# Altium project BLDC_Driver_1_1.PrjPcb
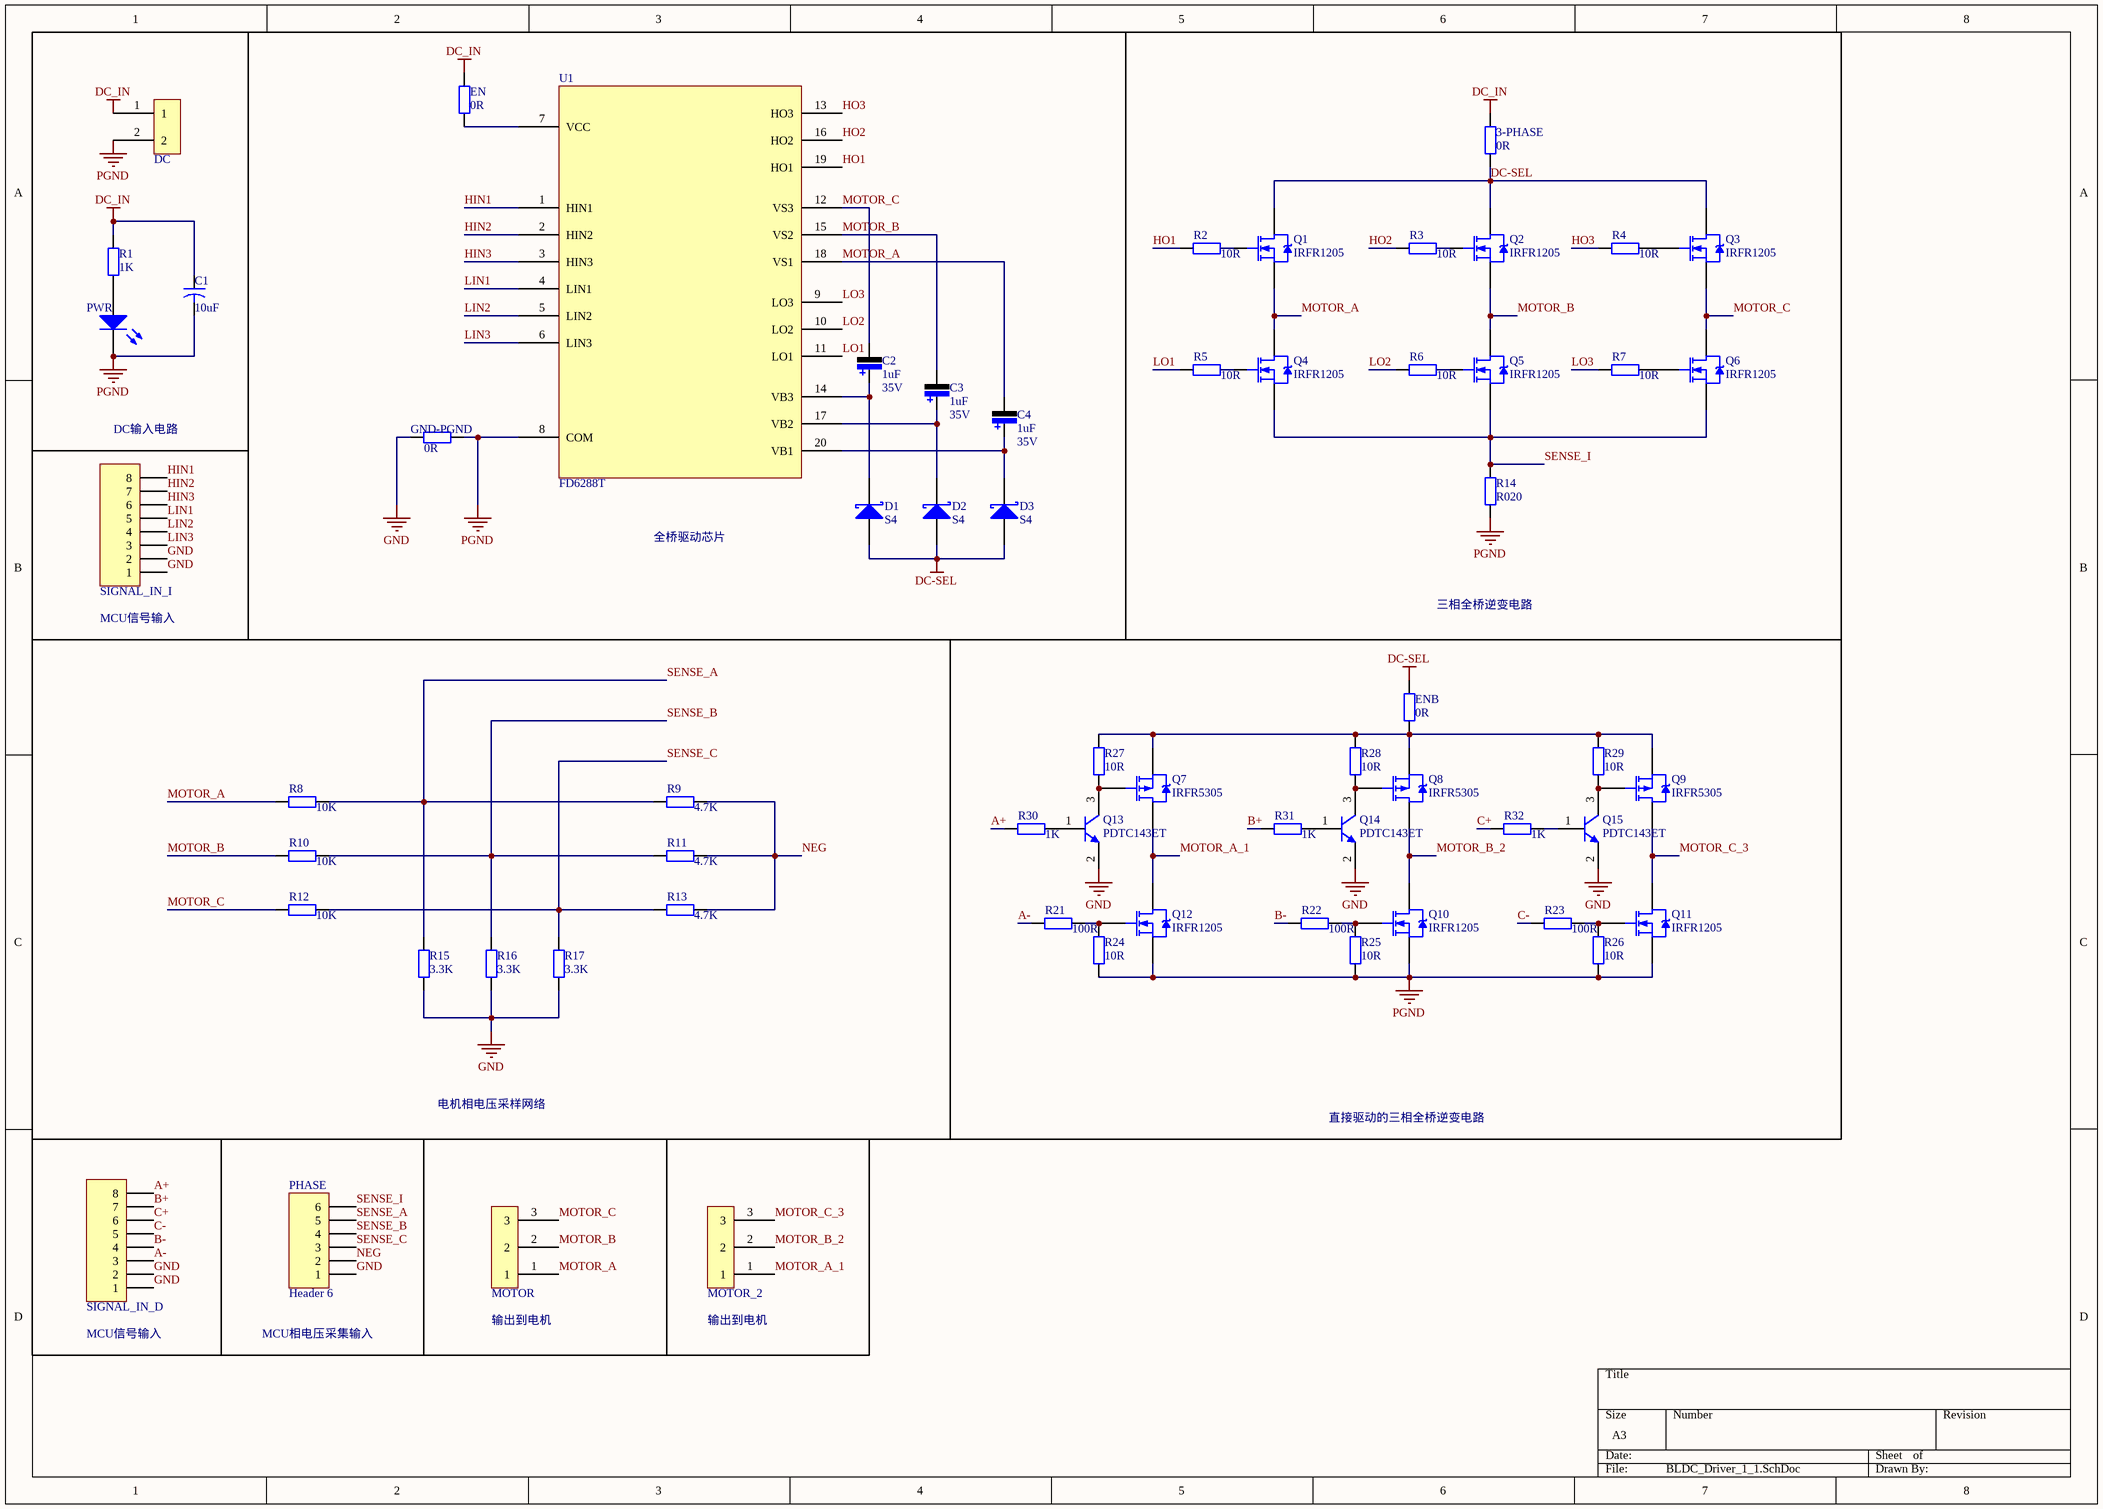
[diagram p0: BLDC_Driver_1_1.SchDoc]
1 sheet, 63 parts. Net scope: global (net labels, ports and power ports of the same name join across sheets).
Board files: BLDC_Driver_1_1.PcbDoc, BLDC_Driver_1_1_2.PcbDoc

## Sheet BLDC_Driver_1_1.SchDoc
size A3

### Parts
3-PHASE  value 0R  [0805-2]  (hidden comment: Res2)
C1  value 10uF  [CAPR5-4X5]  (hidden comment: Cap2)
C2  value 1uF  Vol: 35V  [CAP-3216]  (hidden comment: Cap Pol)
C3  value 1uF  Vol: 35V  [CAP-3216]  (hidden comment: Cap Pol)
C4  value 1uF  Vol: 35V  [CAP-3216]  (hidden comment: Cap Pol)
D1  Type: S4  [DIODE-1206]  (hidden comment: D-Schottky)
D2  Type: S4  [DIODE-1206]  (hidden comment: D-Schottky)
D3  Type: S4  [DIODE-1206]  (hidden comment: D-Schottky)
DC  JXZ2  [JXZ2]  (value not drawn)
EN  value 0R  [0805-2]  (hidden comment: Res2)
ENB  value 0R  [0805-2]  (hidden comment: Res2)
GND-PGND  value 0R  [1206]  (hidden comment: Res2)
MOTOR  JXZ3  [JXZ_3]  (value not drawn)
MOTOR_2  JXZ3  [JXZ_3]  (value not drawn)
PHASE  Header 6  [HDR1X6]
PWR  LED2  [DIODE-1206]  (value not drawn)
Q1  IRFR1205  [TO-252AA_N]
Q2  IRFR1205  [TO-252AA_N]
Q3  IRFR1205  [TO-252AA_N]
Q4  IRFR1205  [TO-252AA_N]
Q5  IRFR1205  [TO-252AA_N]
Q6  IRFR1205  [TO-252AA_N]
Q7  IRFR5305  [TO-252AA_N]
Q8  IRFR5305  [TO-252AA_N]
Q9  IRFR5305  [TO-252AA_N]
Q10  IRFR1205  [TO-252AA_N]
Q11  IRFR1205  [TO-252AA_N]
Q12  IRFR1205  [TO-252AA_N]
Q13  PDTC143ET  [SOT-23]
Q14  PDTC143ET  [SOT-23]
Q15  PDTC143ET  [SOT-23]
R1  value 1K  [1206]  (hidden comment: Res2)
R2  value 10R  [1206]  (hidden comment: Res2)
R3  value 10R  [1206]  (hidden comment: Res2)
R4  value 10R  [1206]  (hidden comment: Res2)
R5  value 10R  [1206]  (hidden comment: Res2)
R6  value 10R  [1206]  (hidden comment: Res2)
R7  value 10R  [1206]  (hidden comment: Res2)
R8  value 10K  [1206]  (hidden comment: Res2)
R9  value 4.7K  [1206]  (hidden comment: Res2)
R10  value 10K  [1206]  (hidden comment: Res2)
R11  value 4.7K  [1206]  (hidden comment: Res2)
R12  value 10K  [1206]  (hidden comment: Res2)
R13  value 4.7K  [1206]  (hidden comment: Res2)
R14  value R020  [AXIAL-0.4]  (hidden comment: Res2)
R15  value 3.3K  [1206]  (hidden comment: Res2)
R16  value 3.3K  [1206]  (hidden comment: Res2)
R17  value 3.3K  [1206]  (hidden comment: Res2)
R21  value 100R  [1206]  (hidden comment: Res2)
R22  value 100R  [1206]  (hidden comment: Res2)
R23  value 100R  [1206]  (hidden comment: Res2)
R24  value 10R  [1206]  (hidden comment: Res2)
R25  value 10R  [1206]  (hidden comment: Res2)
R26  value 10R  [1206]  (hidden comment: Res2)
R27  value 10R  [1206]  (hidden comment: Res2)
R28  value 10R  [1206]  (hidden comment: Res2)
R29  value 10R  [1206]  (hidden comment: Res2)
R30  value 1K  [1206]  (hidden comment: Res2)
R31  value 1K  [1206]  (hidden comment: Res2)
R32  value 1K  [1206]  (hidden comment: Res2)
SIGNAL_IN_D  Header 8  [HDR1X8]  (value not drawn)
SIGNAL_IN_I  Header 8  [HDR1X8]  (value not drawn)
U1  FD6288T  [TSSOP20]

### Blocks framed on the sheet
DC输入电路: C1 DC PWR R1

### Nets
DC-SEL: 3-PHASE.1 D1.1(A) D2.1(A) D3.1(A) ENB.2 Q1.4(D) Q2.4(D) Q3.4(D)
DC_IN: 3-PHASE.2 C1.1 DC.1 EN.2 R1.2
GND: GND-PGND.2 PHASE.1 Q13.2(E) Q14.2(E) Q15.2(E) R15.1 R16.1 R17.1 SIGNAL_IN_D.1 SIGNAL_IN_D.2 SIGNAL_IN_I.1 SIGNAL_IN_I.2
PGND: C1.2 DC.2 GND-PGND.1 PWR.2(K) Q10.3(S) Q11.3(S) Q12.3(S) R14.1 R24.1 R25.1 R26.1 U1.8(COM)
A+: R30.1 SIGNAL_IN_D.8
A-: R21.1 SIGNAL_IN_D.3
B+: R31.1 SIGNAL_IN_D.7
B-: R22.1 SIGNAL_IN_D.4
C+: R32.1 SIGNAL_IN_D.6
C-: R23.1 SIGNAL_IN_D.5
HIN1: SIGNAL_IN_I.8 U1.1(HIN1)
HIN2: SIGNAL_IN_I.7 U1.2(HIN2)
HIN3: SIGNAL_IN_I.6 U1.3(HIN3)
HO1: R2.1 U1.19(HO1)
HO2: R3.1 U1.16(HO2)
HO3: R4.1 U1.13(HO3)
LIN1: SIGNAL_IN_I.5 U1.4(LIN1)
LIN2: SIGNAL_IN_I.4 U1.5(LIN2)
LIN3: SIGNAL_IN_I.3 U1.6(LIN3)
LO1: R5.1 U1.11(LO1)
LO2: R6.1 U1.10(LO2)
LO3: R7.1 U1.9(LO3)
MOTOR_A: C4.2 MOTOR.1 Q1.3(S) Q4.4(D) R8.1 U1.18(VS1)
MOTOR_A_1: MOTOR_2.1 Q7.4(D) Q12.4(D)
MOTOR_B: C3.2 MOTOR.2 Q2.3(S) Q5.4(D) R10.1 U1.15(VS2)
MOTOR_B_2: MOTOR_2.2 Q8.4(D) Q10.4(D)
MOTOR_C: C2.2 MOTOR.3 Q3.3(S) Q6.4(D) R12.1 U1.12(VS3)
MOTOR_C_3: MOTOR_2.3 Q9.4(D) Q11.4(D)
NEG: PHASE.2 R9.2 R11.2 R13.2
SENSE_A: PHASE.5 R8.2 R9.1 R15.2
SENSE_B: PHASE.4 R10.2 R11.1 R16.2
SENSE_C: PHASE.3 R12.2 R13.1 R17.2
SENSE_I: PHASE.6 Q4.3(S) Q5.3(S) Q6.3(S) R14.2
NetC2_1: C2.1 D1.2(K) U1.14(VB3)
NetC3_1: C3.1 D2.2(K) U1.17(VB2)
NetC4_1: C4.1 D3.2(K) U1.20(VB1)
NetEN_1: EN.1 U1.7(VCC)
NetENB_1: ENB.1 Q7.3(S) Q8.3(S) Q9.3(S) R27.2 R28.2 R29.2
NetPWR_1: PWR.1(A) R1.1
NetQ1_1: Q1.1(G) R2.2
NetQ2_1: Q2.1(G) R3.2
NetQ3_1: Q3.1(G) R4.2
NetQ4_1: Q4.1(G) R5.2
NetQ5_1: Q5.1(G) R6.2
NetQ6_1: Q6.1(G) R7.2
NetQ7_1: Q7.1(G) Q13.3(C) R27.1
NetQ8_1: Q8.1(G) Q14.3(C) R28.1
NetQ9_1: Q9.1(G) Q15.3(C) R29.1
NetQ10_1: Q10.1(G) R22.2 R25.2
NetQ11_1: Q11.1(G) R23.2 R26.2
NetQ12_1: Q12.1(G) R21.2 R24.2
NetQ13_1: Q13.1(B) R30.2
NetQ14_1: Q14.1(B) R31.2
NetQ15_1: Q15.1(B) R32.2

### Notes on the sheet
- 全桥驱动芯片
- (near SIGNAL_IN_I) MCU信号输入
- 三相全桥逆变电路
- 电机相电压采样网络
- 直接驱动的三相全桥逆变电路
- (near MOTOR) 输出到电机
- (near MOTOR_2) 输出到电机
- (near SIGNAL_IN_D) MCU信号输入
- MCU相电压采集输入

### Library data of the parts
3-PHASE EN ENB GND-PGND R1-R17 R21-R32 = Res2: Resistor; Published: 8-Jun-2000; LatestRevisionDate: 17-Jul-2002; LatestRevisionNote: Re-released for DXP Platform.; PackageReference: AXIAL-0.4; Publisher: Altium Limited; PackageDescription: Axial Device, Thru-Hole; 2 Leads; 0.4 in Pin Spacing
C1 = Cap2: Capacitor; Published: 23-Sep-2002; PackageReference: CAPR5-4X5; Publisher: Altium Limited; PackageDescription: Capacitor; 2 Leads
C2-C4 = Cap Pol: 极性电解电容; Published: 8-Jun-2000; LatestRevisionDate: 17-Jul-2002; LatestRevisionNote: Re-released for DXP Platform.; PackageReference: RB7.6-15; Publisher: Altium Limited
D1-D3 = D-Schottky: 肖特基二极管; Published: 8-Jun-2000; LatestRevisionDate: 17-Jul-2002; LatestRevisionNote: Re-released for DXP Platform.; PackageReference: SMB; Publisher: Altium Limited; Code_JEDEC: DO-214-AA
PHASE = Header 6: Header, 6-Pin; LatestRevisionDate: 17-Jul-2002; LatestRevisionNote: Re-released for DXP Platform.; Publisher: Altium Limited
PWR = LED2: Typical RED, GREEN, YELLOW, AMBER GaAs LED; Published: 8-Jun-2000; LatestRevisionDate: 17-Jul-2002; LatestRevisionNote: Re-released for DXP Platform.; PackageVersion: Feb-2002; PackageReference: 3.2X1.6X1.1; Publisher: Altium Limited; PackageDescription: SM LED; 2 Flat Leads
Q1-Q6 Q10-Q12 = IRFR1205: HEXFET Power MOSFET; Note: Pin 2 is trimmed and is electrically connected to Drain.; Published: 8-Jun-2000; LatestRevisionDate: 20-Nov-2009; LatestRevisionNote: IPC-7351 Footprint Added.; DatasheetVersion: PD-91318B; PackageVersion: Feb-2003; PackageReference: TO-252AA; Publisher: Altium Limited; PackageDescription: 3-Pin HEXFET Package 2.28 mm Pitch, 9.9 mm Lead Span; Code_JEDEC: TO-252-AA; ComponentLink1Description: Manufacturer Link; ComponentLink1URL: http://www.irf.com/; ComponentLink2Description: Datasheet; ComponentLink2URL: http://www.irf.com/product-info/datasheets/data/irfr1205.pdf
Q7-Q9 = IRFR5305: HEXFET Power MOSFET; Note: Pin 2 is trimmed and is electrically connected to Drain.; Published: 8-Jun-2000; LatestRevisionDate: 20-Nov-2009; LatestRevisionNote: IPC-7351 Footprint Added.; DatasheetVersion: PD-9.1402; PackageVersion: Feb-2003; PackageReference: TO-252AA; Publisher: Altium Limited; PackageDescription: 3-Pin HEXFET Package 2.28 mm Pitch, 9.9 mm Lead Span; Code_JEDEC: TO-252-AA; ComponentLink1Description: Manufacturer Link; ComponentLink1URL: http://www.irf.com/; ComponentLink2Description: Datasheet; ComponentLink2URL: http://www.irf.com/product-info/datasheets/data/irfr5305.pdf
Q13-Q15 = SS8050: NPN贴片三极管; Published: 8-Jun-2000; LatestRevisionDate: 15-Jan-2003; LatestRevisionNote: PCB Footprint 'BCY-W3/D4.7' replaced; DatasheetDocument: 1997; PackageDocument: Sep-1998; PackageReference: TO-92A; Publisher: Altium Limited; Code_JEDEC: TO-92A; ComponentLink1Description: Manufacturer Link; ComponentLink1URL: http://www.fairchildsemi.com/; ComponentLink2Description: Datasheet; ComponentLink2URL: http://www.fairchildsemi.com/ds/2N%2F2N3904.pdf
SIGNAL_IN_D SIGNAL_IN_I = Header 8: Header, 8-Pin; LatestRevisionDate: 17-Jul-2002; LatestRevisionNote: Re-released for DXP Platform.; Publisher: Altium Limited